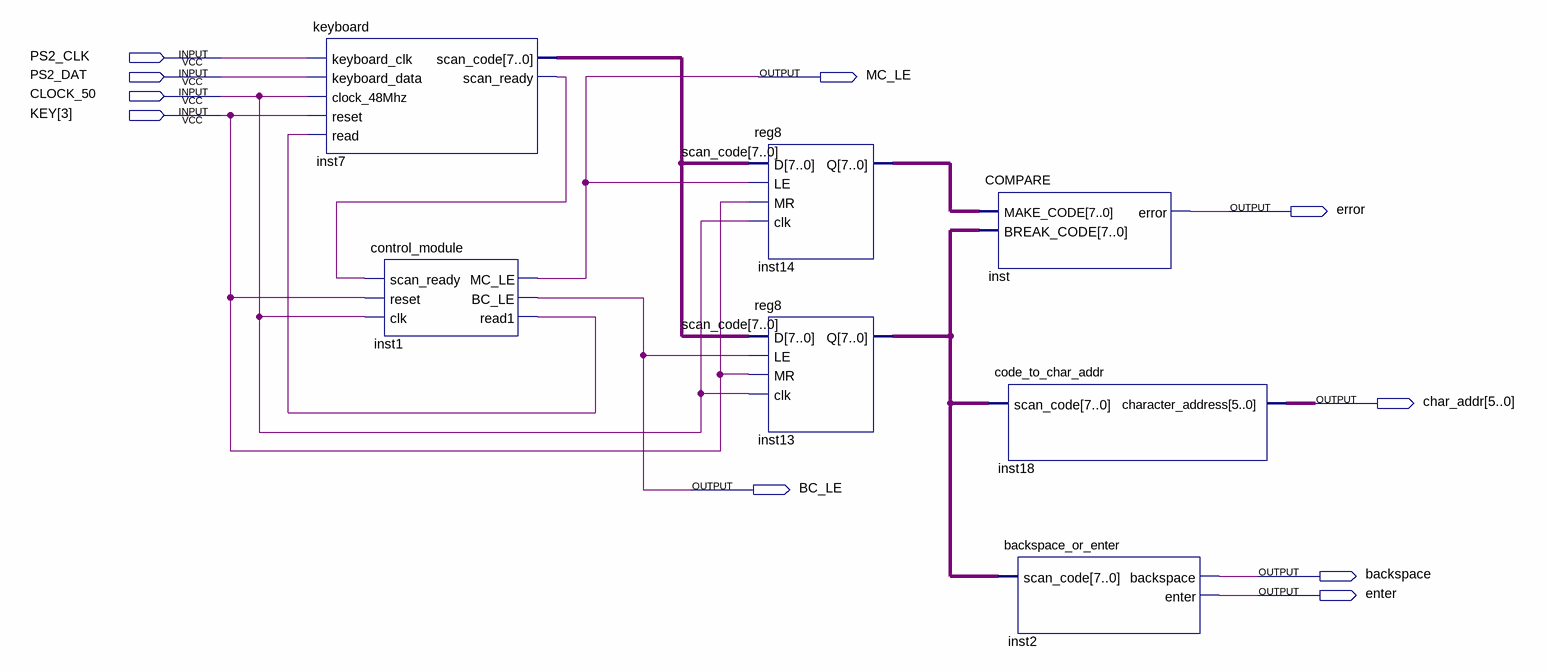
[diagram p0: schematic sheet]
// Quartus schematic keyboard_to_char_addr.bdf as structural Verilog: 7 symbols, 10 pins
module keyboard_to_char_addr (
  input  PS2_CLK,
  input  PS2_DAT,
  input  CLOCK_50,
  input  [3:3] KEY,
  output MC_LE,
  output error,
  output [5:0] char_addr,
  output BC_LE,
  output backspace,
  output enter
);

  wire inst1_read1, inst7_scan_ready;
  wire [7:0] inst13_q, inst14_q, scan_code;

  keyboard inst7 (
    .keyboard_clk(PS2_CLK), .keyboard_data(PS2_DAT), .clock_48Mhz(CLOCK_50), .reset(KEY[3]),
    .read(inst1_read1), .scan_code(scan_code), .scan_ready(inst7_scan_ready));
  control_module inst1 (
    .scan_ready(inst7_scan_ready), .reset(KEY[3]), .clk(CLOCK_50), .MC_LE(MC_LE), .BC_LE(BC_LE),
    .read1(inst1_read1));
  reg8 inst14 (.D(scan_code), .LE(MC_LE), .MR(KEY[3]), .clk(CLOCK_50), .Q(inst14_q));
  reg8 inst13 (.D(scan_code), .LE(BC_LE), .MR(KEY[3]), .clk(CLOCK_50), .Q(inst13_q));
  COMPARE inst (.MAKE_CODE(inst14_q), .BREAK_CODE(inst13_q), .error(error));
  code_to_char_addr inst18 (.scan_code(inst13_q), .character_address(char_addr));
  backspace_or_enter inst2 (.scan_code(inst13_q), .backspace(backspace), .enter(enter));
endmodule
